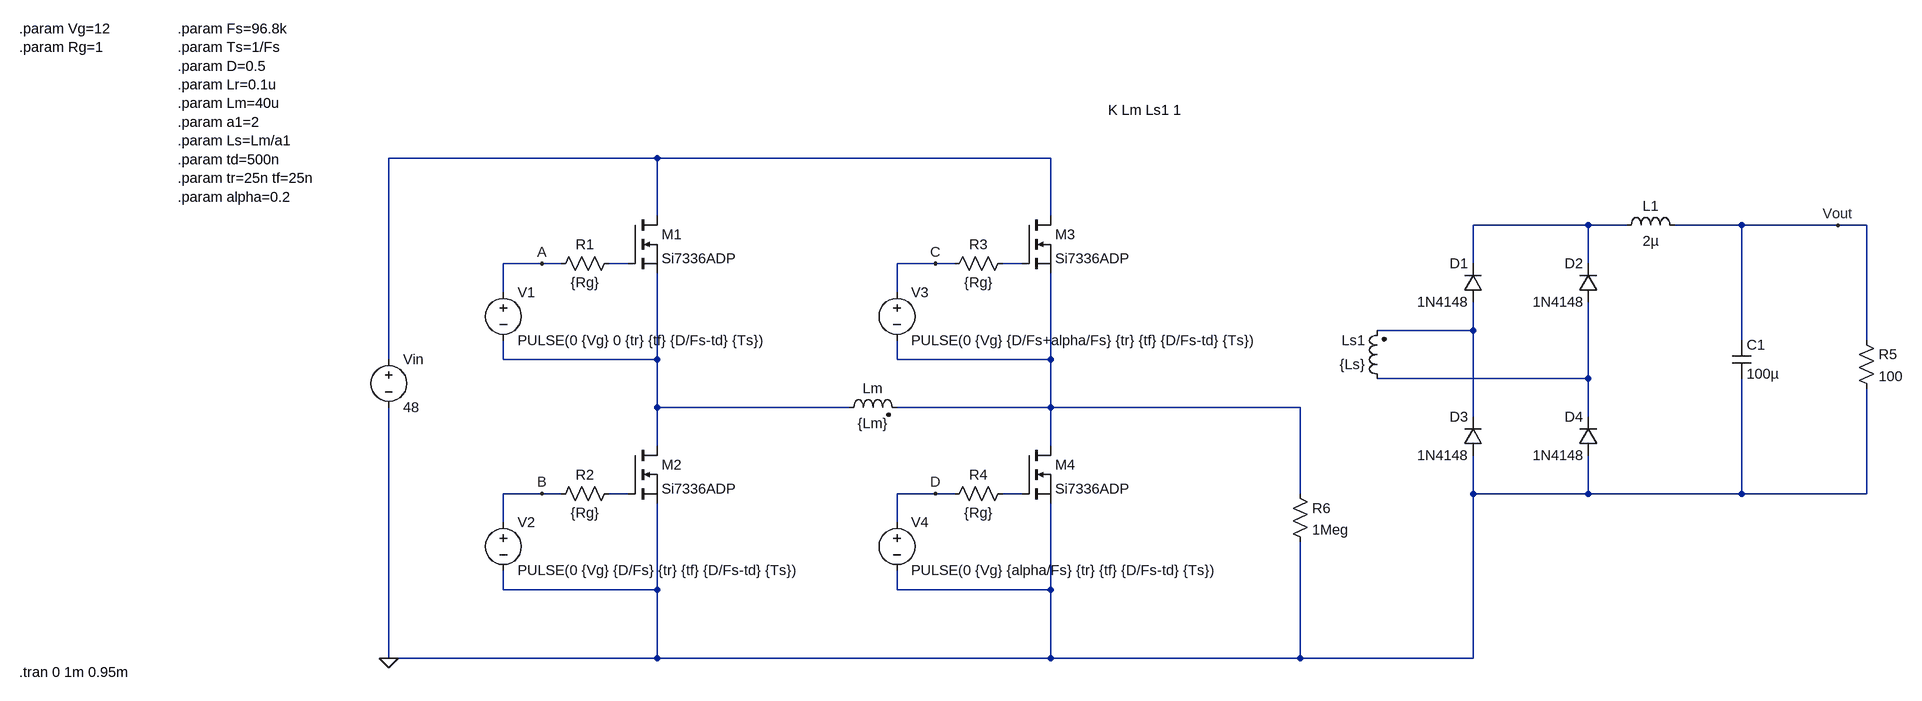
[diagram p0: schematic LLC.asc]
LLC.asc, the LTspice schematic file:
Version 4
SHEET 1 2180 872
WIRE 96 -32 -576 -32
WIRE 752 -32 96 -32
WIRE 96 64 96 -32
WIRE 752 64 752 -32
WIRE 1648 80 1456 80
WIRE 1712 80 1648 80
WIRE 1904 80 1792 80
WIRE 2064 80 1904 80
WIRE 2112 80 2064 80
WIRE -96 144 -160 144
WIRE -64 144 -96 144
WIRE 48 144 16 144
WIRE 560 144 496 144
WIRE 592 144 560 144
WIRE 704 144 672 144
WIRE 1456 144 1456 80
WIRE 1648 144 1648 80
WIRE -160 192 -160 144
WIRE 496 192 496 144
WIRE 1456 256 1456 208
WIRE 1456 256 1296 256
WIRE 1904 272 1904 80
WIRE 2112 272 2112 80
WIRE -576 304 -576 -32
WIRE -160 304 -160 272
WIRE 96 304 96 160
WIRE 96 304 -160 304
WIRE 496 304 496 272
WIRE 752 304 752 160
WIRE 752 304 496 304
WIRE 1648 336 1648 208
WIRE 1648 336 1296 336
WIRE 96 384 96 304
WIRE 416 384 96 384
WIRE 752 384 752 304
WIRE 752 384 496 384
WIRE 1168 384 752 384
WIRE 1456 400 1456 256
WIRE 1648 400 1648 336
WIRE 96 448 96 384
WIRE 752 448 752 384
WIRE -96 528 -160 528
WIRE -64 528 -96 528
WIRE 48 528 16 528
WIRE 560 528 496 528
WIRE 592 528 560 528
WIRE 704 528 672 528
WIRE 1168 528 1168 384
WIRE 1456 528 1456 464
WIRE 1648 528 1648 464
WIRE 1648 528 1456 528
WIRE 1904 528 1904 336
WIRE 1904 528 1648 528
WIRE 2112 528 2112 352
WIRE 2112 528 1904 528
WIRE -160 576 -160 528
WIRE 496 576 496 528
WIRE -160 688 -160 656
WIRE 96 688 96 544
WIRE 96 688 -160 688
WIRE 496 688 496 656
WIRE 752 688 752 544
WIRE 752 688 496 688
WIRE -576 832 -576 384
WIRE 96 832 96 688
WIRE 96 832 -576 832
WIRE 752 832 752 688
WIRE 752 832 96 832
WIRE 1168 832 1168 608
WIRE 1168 832 752 832
WIRE 1456 832 1456 528
WIRE 1456 832 1168 832
FLAG -96 144 A
FLAG -96 528 B
FLAG 560 144 C
FLAG 560 528 D
FLAG -576 832 0
FLAG 2064 80 Vout
SYMBOL nmos 48 64 R0
SYMATTR InstName M1
SYMATTR Value Si7336ADP
SYMBOL voltage -160 176 R0
WINDOW 123 0 0 Left 0
WINDOW 39 0 0 Left 0
SYMATTR InstName V1
SYMATTR Value PULSE(0 {Vg} 0 {tr} {tf} {D/Fs-td} {Ts})
SYMBOL res 32 128 R90
WINDOW 0 0 56 VBottom 2
WINDOW 3 32 56 VTop 2
SYMATTR InstName R1
SYMATTR Value {Rg}
SYMBOL nmos 48 448 R0
SYMATTR InstName M2
SYMATTR Value Si7336ADP
SYMBOL voltage -160 560 R0
SYMATTR InstName V2
SYMATTR Value PULSE(0 {Vg} {D/Fs} {tr} {tf} {D/Fs-td} {Ts})
SYMBOL res 32 512 R90
WINDOW 0 0 56 VBottom 2
WINDOW 3 32 56 VTop 2
SYMATTR InstName R2
SYMATTR Value {Rg}
SYMBOL nmos 704 64 R0
SYMATTR InstName M3
SYMATTR Value Si7336ADP
SYMBOL voltage 496 176 R0
WINDOW 123 0 0 Left 0
WINDOW 39 0 0 Left 0
SYMATTR InstName V3
SYMATTR Value PULSE(0 {Vg} {D/Fs+alpha/Fs} {tr} {tf} {D/Fs-td} {Ts})
SYMBOL res 688 128 R90
WINDOW 0 0 56 VBottom 2
WINDOW 3 32 56 VTop 2
SYMATTR InstName R3
SYMATTR Value {Rg}
SYMBOL nmos 704 448 R0
SYMATTR InstName M4
SYMATTR Value Si7336ADP
SYMBOL voltage 496 560 R0
WINDOW 123 0 0 Left 0
WINDOW 39 0 0 Left 0
SYMATTR InstName V4
SYMATTR Value PULSE(0 {Vg} {alpha/Fs} {tr} {tf} {D/Fs-td} {Ts})
SYMBOL res 688 512 R90
WINDOW 0 0 56 VBottom 2
WINDOW 3 32 56 VTop 2
SYMATTR InstName R4
SYMATTR Value {Rg}
SYMBOL voltage -576 288 R0
WINDOW 123 0 0 Left 0
WINDOW 39 0 0 Left 0
SYMATTR InstName Vin
SYMATTR Value 48
SYMBOL ind2 400 400 R270
WINDOW 0 32 56 VTop 2
WINDOW 3 5 56 VBottom 2
SYMATTR InstName Lm
SYMATTR Value {Lm}
SYMATTR Type ind
SYMBOL ind2 1312 352 R180
WINDOW 0 36 80 Left 2
WINDOW 3 36 40 Left 2
SYMATTR InstName Ls1
SYMATTR Value {Ls}
SYMATTR Type ind
SYMBOL diode 1472 208 R180
WINDOW 0 24 64 Left 2
WINDOW 3 24 0 Left 2
SYMATTR InstName D1
SYMATTR Value 1N4148
SYMBOL diode 1664 208 R180
WINDOW 0 24 64 Left 2
WINDOW 3 24 0 Left 2
SYMATTR InstName D2
SYMATTR Value 1N4148
SYMBOL diode 1472 464 R180
WINDOW 0 24 64 Left 2
WINDOW 3 24 0 Left 2
SYMATTR InstName D3
SYMATTR Value 1N4148
SYMBOL diode 1664 464 R180
WINDOW 0 24 64 Left 2
WINDOW 3 24 0 Left 2
SYMATTR InstName D4
SYMATTR Value 1N4148
SYMBOL ind 1696 96 R270
WINDOW 0 32 56 VTop 2
WINDOW 3 5 56 VBottom 2
SYMATTR InstName L1
SYMATTR Value 2µ
SYMBOL cap 1888 272 R0
SYMATTR InstName C1
SYMATTR Value 100µ
SYMBOL res 2096 256 R0
SYMATTR InstName R5
SYMATTR Value 100
SYMBOL res 1152 512 R0
SYMATTR InstName R6
SYMATTR Value 1Meg
TEXT -1192 -248 Left 2 !.param Vg=12\n.param Rg=1
TEXT -928 -248 Left 2 !.param Fs=96.8k\n.param Ts=1/Fs\n.param D=0.5\n.param Lr=0.1u\n.param Lm=40u\n.param a1=2\n.param Ls=Lm/a1\n.param td=500n\n.param tr=25n tf=25n\n.param alpha=0.2
TEXT -1192 856 Left 2 !.tran 0 1m 0.95m
TEXT 848 -112 Left 2 !K Lm Ls1 1

The netlist it stands for:
* LLC.asc
M1 N001 N003 N006 N006 Si7336ADP
V1 A N006 PULSE(0 {Vg} 0 {tr} {tf} {D/Fs-td} {Ts})
R1 N003 A {Rg}
M2 N006 N009 0 0 Si7336ADP
V2 B 0 PULSE(0 {Vg} {D/Fs} {tr} {tf} {D/Fs-td} {Ts})
R2 N009 B {Rg}
M3 N001 N004 N007 N007 Si7336ADP
V3 C N007 PULSE(0 {Vg} {D/Fs+alpha/Fs} {tr} {tf} {D/Fs-td} {Ts})
R3 N004 C {Rg}
M4 N007 N010 0 0 Si7336ADP
V4 D 0 PULSE(0 {Vg} {alpha/Fs} {tr} {tf} {D/Fs-td} {Ts})
R4 N010 D {Rg}
Vin N001 0 48
Lm N006 N007 {Lm}
Ls1 N008 N005 {Ls}
D1 N005 N002 1N4148
D2 N008 N002 1N4148
D3 0 N005 1N4148
D4 0 N008 1N4148
L1 N002 Vout 2µ
C1 Vout 0 100µ
R5 Vout 0 100
R6 N007 0 1Meg
.model D D
.lib standard.dio
.model NMOS NMOS
.model PMOS PMOS
.lib standard.mos
.param Vg=12
.param Rg=1
.param Fs=96.8k
.param Ts=1/Fs
.param D=0.5
.param Lr=0.1u
.param Lm=40u
.param a1=2
.param Ls=Lm/a1
.param td=500n
.param tr=25n tf=25n
.param alpha=0.2
.tran 0 1m 0.95m
K Lm Ls1 1
.backanno
.end